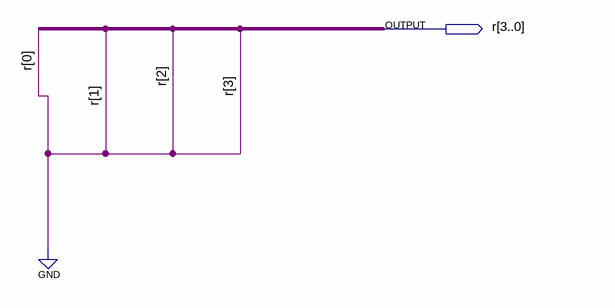
[diagram p0: schematic sheet]
// Quartus schematic Result_Inicial.bdf as structural Verilog: 0 symbols, 1 pins
module Result_Inicial (
  output [3:0] r
);


  assign r = 4'b0000;
endmodule
